# Altium schematic sheet low noise amplifier module.SchDoc: Low noise amplifier module
size A4; Date: 2011-12-02; Author: Artur Scholz; DocumentNumber: LibreCube LC23-01a
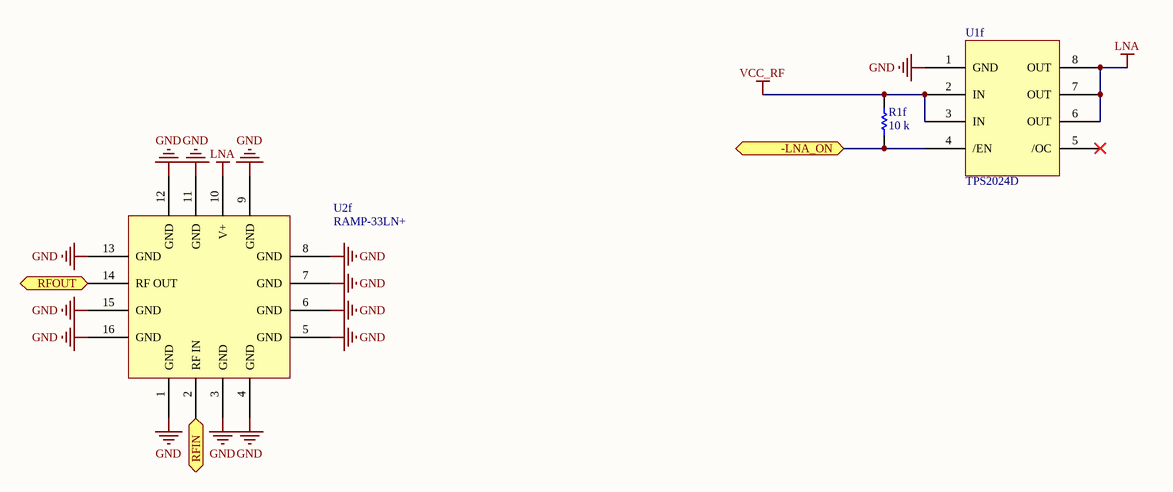
[diagram p0: low noise amplifier module.SchDoc]

## Parts
R1f  10 k  [0603]
U1f  TPS2024D  [SO-8]
U2f  RAMP-33LN+  [CK605]

## Ports
-LNA_ON, RFIN, RFOUT

## Nets
GND: U1f.1(GND) U2f.1(GND) U2f.3(GND) U2f.4(GND) U2f.5(GND) U2f.6(GND) U2f.7(GND) U2f.8(GND) U2f.9(GND) U2f.11(GND) U2f.12(GND) U2f.13(GND) U2f.15(GND) U2f.16(GND)
LNA: U1f.6(OUT) U1f.7(OUT) U1f.8(OUT) U2f.10(V+)
VCC_RF: R1f.2 U1f.2(IN) U1f.3(IN)
-LNA_ON: R1f.1 U1f.4(/EN) ; port -LNA_ON
RFIN: U2f.2(RF_IN) ; port RFIN
RFOUT: U2f.14(RF_OUT) ; port RFOUT

Not connected (* = marked no-connect by the designer): U1f 5(/OC)*

## Library data of the parts
R1f = Res1: Value: 10K; Published: 8-Jun-2000; LatestRevisionDate: 17-Jul-2002; LatestRevisionNote: Re-released for DXP Platform.; PackageReference: AXIAL-0.3; Publisher: Altium Limited
U1f = TPS2024: 296-2564-5-ND